# EAGLE design PaganiniClock (EAGLE 7.2.0)
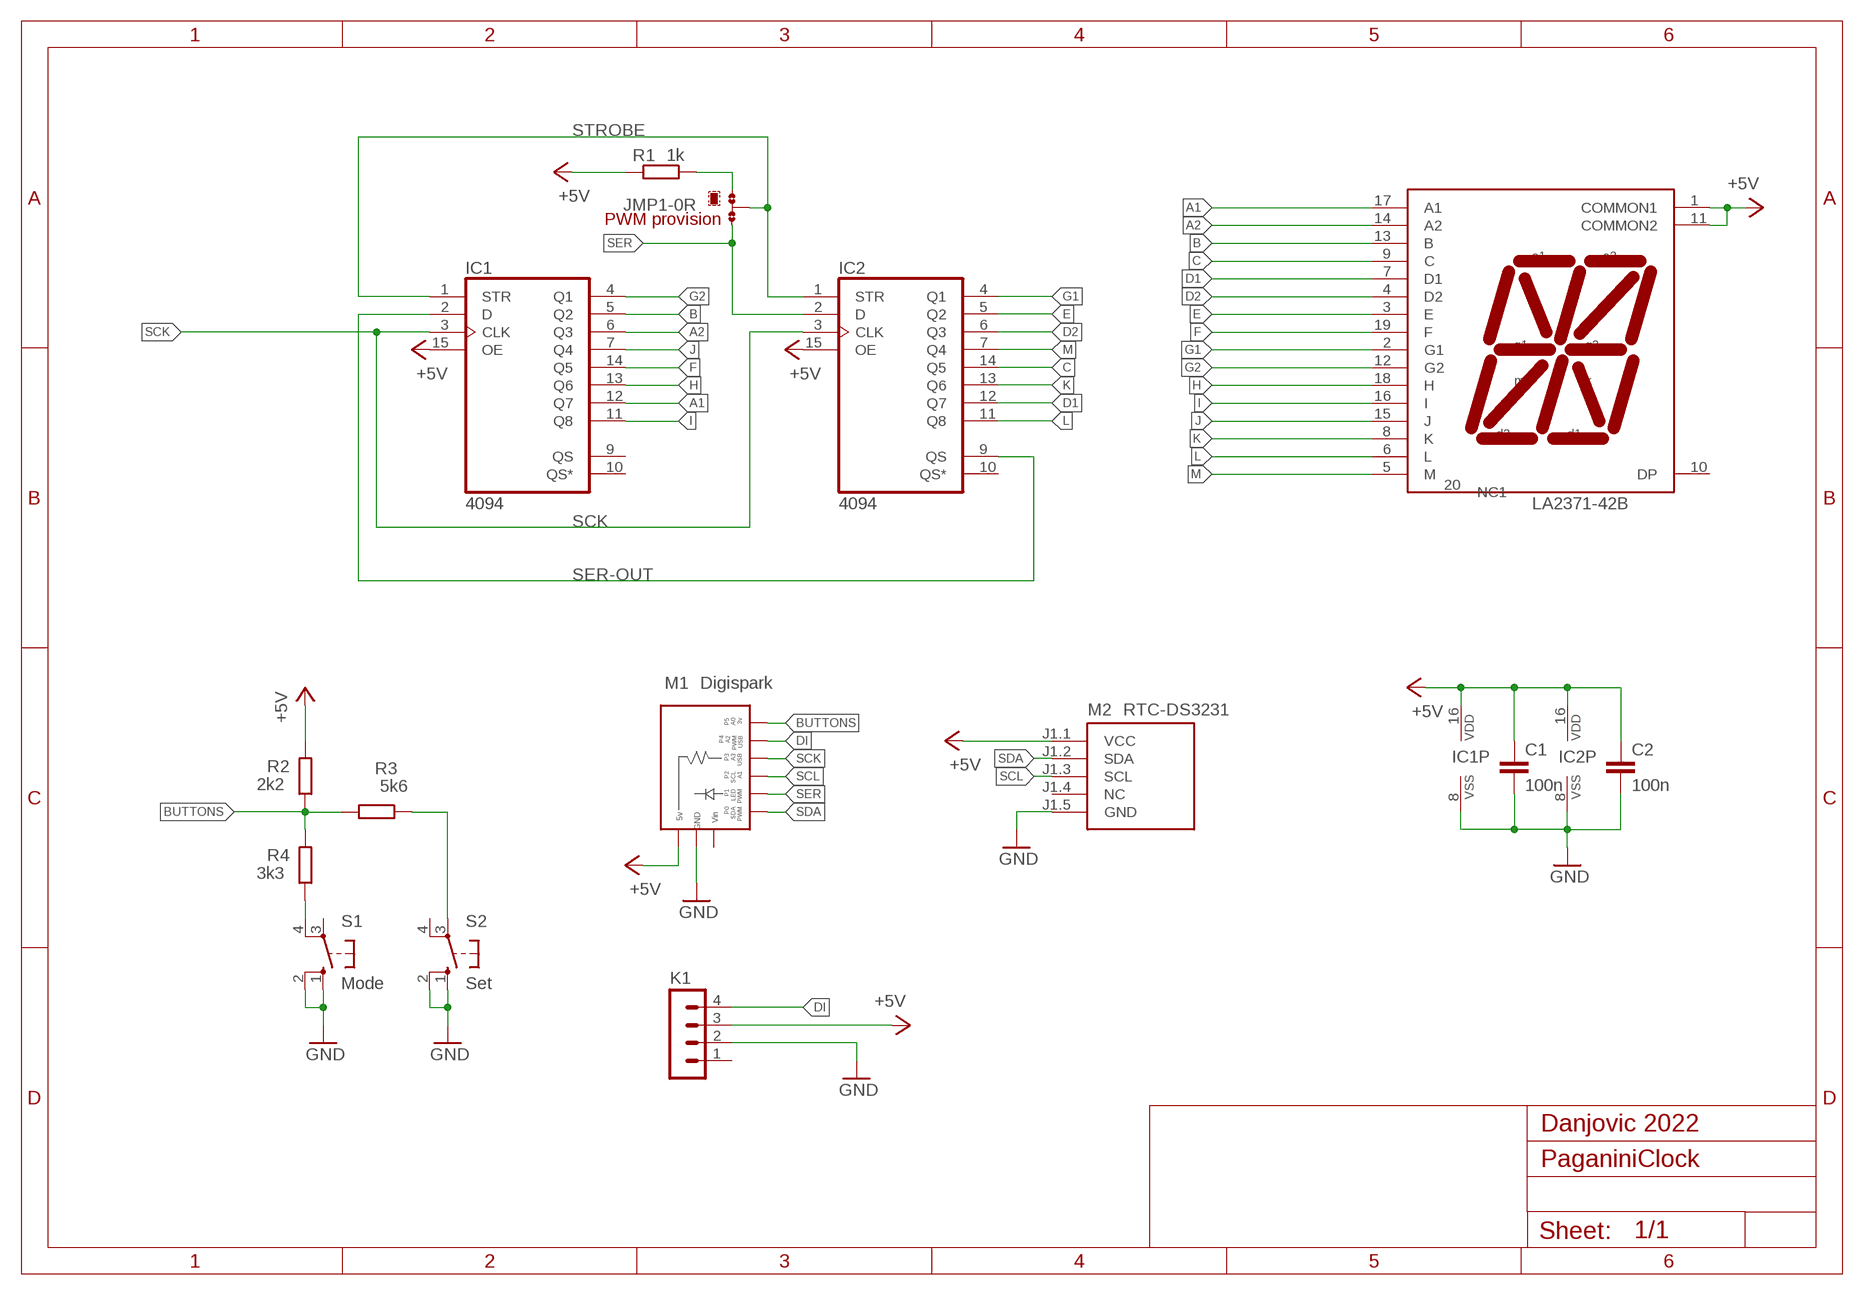
[diagram p0: schematic, sheet 1]

## Parts
C1  100n  C-EUC050-024X044L  [C050-024X044L]
C2  100n  C-EUC050-024X044L  [C050-024X044L]
DS1  LA2371-42B  LA(C)2371-42B-M1""  [LA(C)2371-42B-M1]
IC1  4094  [DIL16R]
IC2  4094  [DIL16R]
JMP1  DP_Option  0R-JUMPB  [B0R-JMP]
K1  MA04-1  [MA04-1]
M1  Digispark  DIGISPARK-SOCKET  [DIGISPARK_SOCKET]
M2  RTC-DS3231  [RTC-DS3231_SMALL]
R1  1k  R-EU_0204/7L  [0204/7L]
R2  2k2  R-EU_0204/7L  [0204/7L]
R3  5k6  R-EU_0204/7L  [0204/7L]
R4  3k3  R-EU_0204/7L  [0204/7L]
S1  10-XX  [B3F-10XX]
S2  10-XX  [B3F-10XX]

## Nets
+5V: C1.1 C2.1 DS1.1(COMMON1) DS1.11(COMMON2) IC1.15(OE) IC1.16(VDD) IC2.15(OE) IC2.16(VDD) K1.3 M1.5V M2.J1.1(VCC) R1.2 R2.2
A1: DS1.17(A1) IC1.12(Q7)
A2: DS1.14(A2) IC1.6(Q3)
B: DS1.13(B) IC1.5(Q2)
BUTTONS: M1.P5 R2.1 R3.2 R4.2
C: DS1.9(C) IC2.14(Q5)
D1: DS1.7(D1) IC2.12(Q7)
D2: DS1.4(D2) IC2.6(Q3)
DI: K1.4 M1.P4
E: DS1.3(E) IC2.5(Q2)
F: DS1.19(F) IC1.14(Q5)
G1: DS1.2(G1) IC2.4(Q1)
G2: DS1.12(G2) IC1.4(Q1)
GND: C1.2 C2.2 IC1.8(VSS) IC2.8(VSS) K1.2 M1.GND M2.J1.5(GND) S1.1(S) S1.2(S1) S2.1(S) S2.2(S1)
H: DS1.18(H) IC1.13(Q6)
I: DS1.16(I) IC1.11(Q8)
J: DS1.15(J) IC1.7(Q4)
K: DS1.8(K) IC2.13(Q6)
L: DS1.6(L) IC2.11(Q8)
M: DS1.5(M) IC2.7(Q4)
N$1: JMP1.1 R1.1
N$18: R3.1 S2.3(P)
N$20: R4.1 S1.4(P1)
SCK: IC1.3(CLK) IC2.3(CLK) M1.P3
SCL: M1.P2 M2.J1.3(SCL)
SDA: M1.P0 M2.J1.2(SDA)
SER: IC2.2(D) JMP1.3 M1.P1
SER-OUT: IC1.2(D) IC2.9(QS)
STROBE: IC1.1(STR) IC2.1(STR) JMP1.2
Unconnected: DS1.10(DP) DS1.20(NC1) IC1.9(QS) IC1.10(QS*) IC2.10(QS*) K1.1 M2.J1.4(NC) S1.3(P) S2.4(P1)

## Notes on the sheet
- PWM provision
- LA2371-42B
- Digispark
- Mode | Set
- Danjovic 2022

## Power pins joined to a net without a drawn wire
VIN: M1.VIN

## Library data of the parts
C1 C2 = rcl:C-EU: CAPACITOR, European symbol
DS1 = la2371-42b:LA(C)2371-42B-M1: PART NO. : LA(C)2371-42B-M1 EWRN 2.3"(56.8mm)SINGLE DIGIT DISPLAY http://www.ledtech.com.tw
IC1 IC2 = 40xx:4094: 8-stage SHIFT/STORE REGISTER, tri-state
JMP1 = jump-0r-smd:0R-JUMP: SMD 0R 0805 Jumper
K1 = con-lstb:MA04-1: PIN HEADER; OC_FARNELL: unknown; OC_NEWARK: unknown
M1 = Digistump:DIGISPARK: Digispark http://digistump.com/wiki/digispark
M2 = RTC:RTC-DS3231
R1-R4 = rcl:R-EU_: RESISTOR, European symbol
S1 S2 = switch-omron:10-XX: OMRON SWITCH; MPN: B3F-1000; OC_FARNELL: 176432; OC_NEWARK: 36M3542

## Board
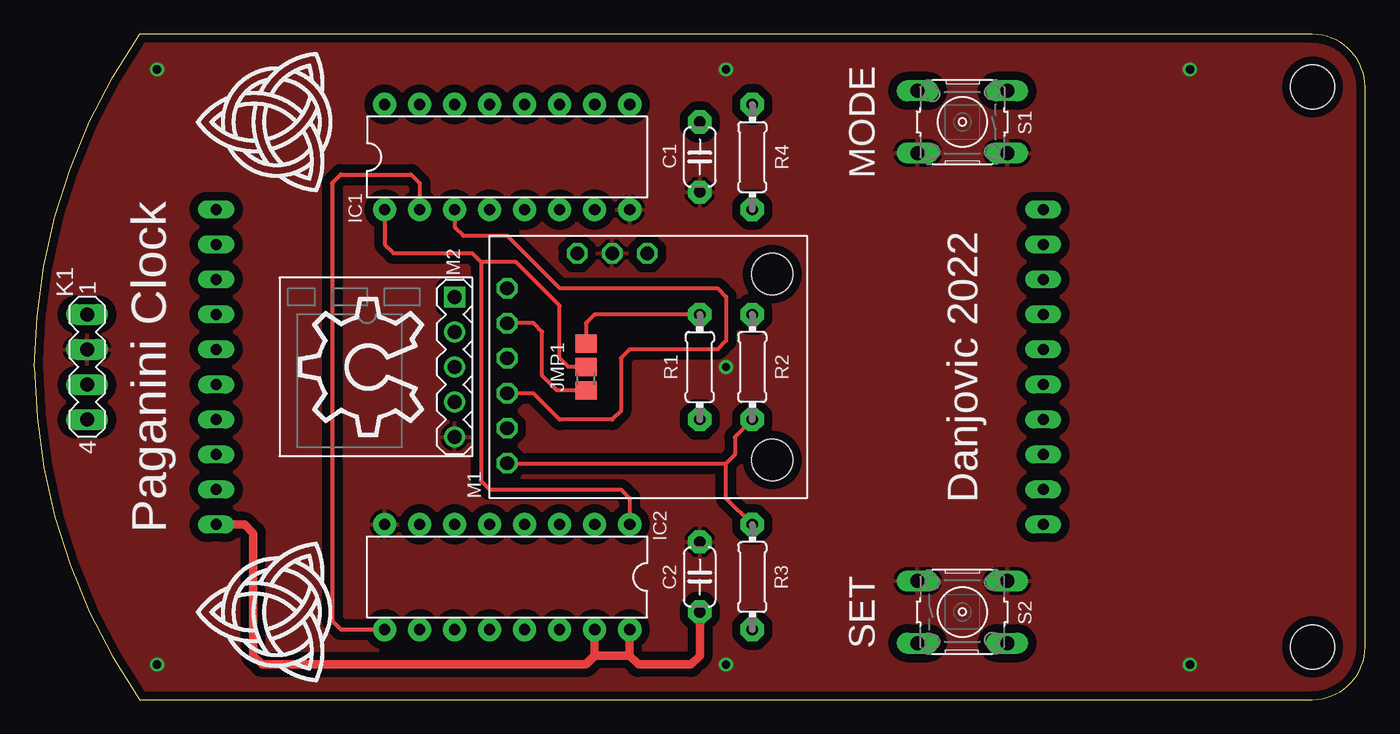
[diagram p1: board, top side]
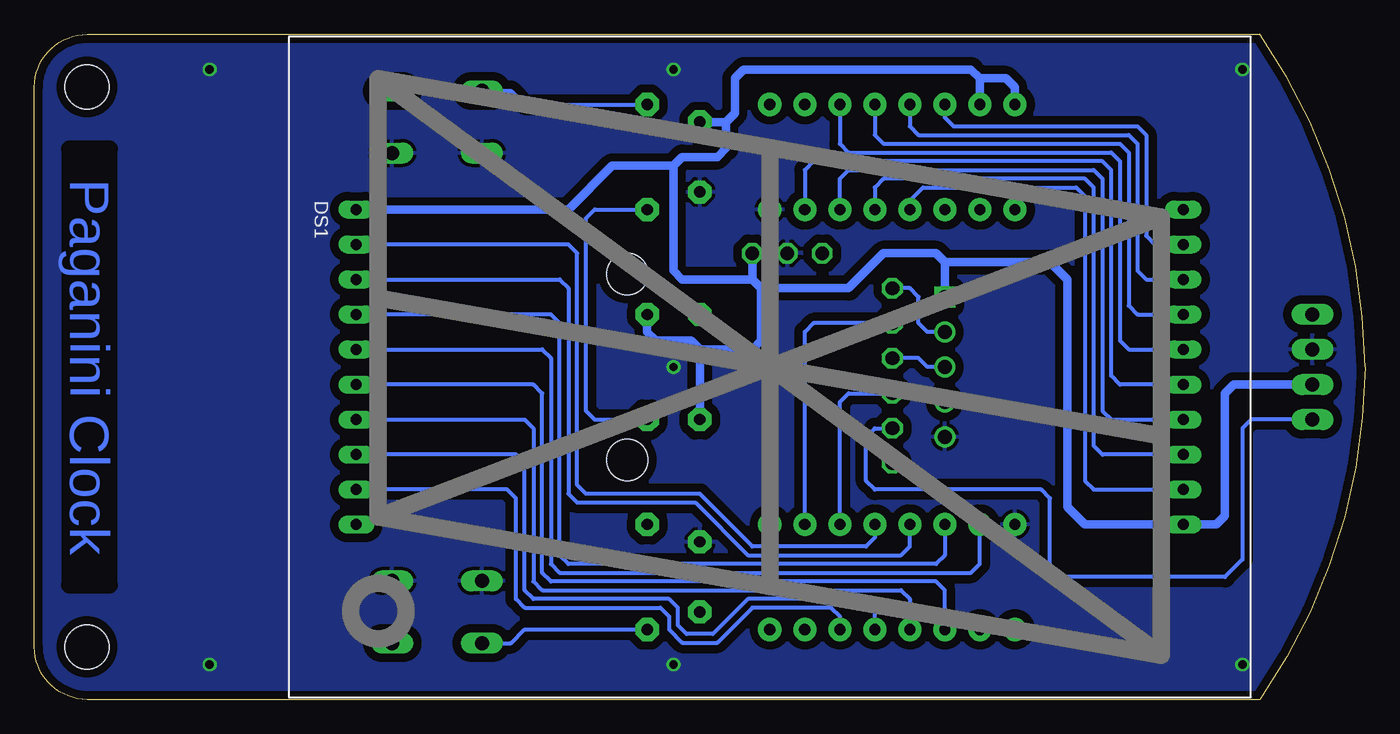
[diagram p2: board, bottom side, seen from below]

Size 96.52 x 48.26 mm. Coordinates in mm from the lower left corner, seen from the top.
Outline: 96.52,3.81 96.52,44.45 arc90 92.71,48.26 7.62,48.26 arc34 0,24.13 arc34 7.62,0 92.71,0 arc90 96.52,3.81
Copper layers (1*16): Top 0.035mm / dielectric 1.5mm / Bottom 0.035mm
Design rules "default *": minimum track width 10mil, minimum drill 24mil, track to track 8mil, track to pad 8mil, pad to pad 8mil, via to via 8mil, smd to smd 8mil, copper to edge 20mil, drill to drill 8mil, minimum pad ring 10mil, minimum via ring 8mil, stop-mask expansion 4mil, vias tented up to drill 0mil, thermal gap 10mil
Holes 3.2 mm at 92.71,3.81 92.71,44.45

### Footprints (pad centres in the part's own frame; a part is rotated, then mirrored left to right if it is on the bottom)
C050-024X044L = drill 0.813 pad 1.676 octagon: 1 -2.54,0; 2 2.54,0
LA(C)2371-42B-M1 = drill 0.8 long: 1 -11.43,-30; 2 -8.89,-30; 3 -6.35,-30; 4 -3.81,-30; 5 -1.27,-30; 6 1.27,-30; 7 3.81,-30; 8 6.35,-30; 9 8.89,-30; 10 11.43,-30; 11 11.43,30; 12 8.89,30; 13 6.35,30; 14 3.81,30; 15 1.27,30; 16 -1.27,30; 17 -3.81,30; 18 -6.35,30; 19 -8.89,30; 20 -11.43,30
DIL16R = drill 0.813 pad 1.676: 1 -8.89,-3.81; 2 -6.35,-3.81; 3 -3.81,-3.81; 4 -1.27,-3.81; 5 1.27,-3.81; 6 3.81,-3.81; 7 6.35,-3.81; 8 8.89,-3.81; 9 8.89,3.81; 10 6.35,3.81; 11 3.81,3.81; 12 1.27,3.81; 13 -1.27,3.81; 14 -3.81,3.81; 15 -6.35,3.81; 16 -8.89,3.81
B0R-JMP = smd 1.5 x 1.3: 1 0,1.7; 2 0,0; 3 0,-1.7
MA04-1 = drill 1.016 long: 1 -3.81,0; 2 -1.27,0; 3 1.27,0; 4 3.81,0
DIGISPARK_SOCKET = drill 1 octagon: 5V 17.78,-11.43; GND 17.78,-8.89; P0 15.24,-1.27; P1 12.7,-1.27; P2 10.16,-1.27; P3 7.62,-1.27; P4 5.08,-1.27; P5 2.54,-1.27; VIN 17.78,-6.35 | hole 3: 2.775,-20.5; 16.275,-20.5
RTC-DS3231_SMALL = drill 1 square: J1.1 -5.08,6.35 | drill 1: J1.2 -2.54,6.35; J1.3 0,6.35; J1.4 2.54,6.35; J1.5 5.08,6.35
0204/7L = drill 0.813 pad 1.676 octagon: 1 -3.81,0; 2 3.81,0
B3F-10XX = drill 1.016 long: 1 -3.251,2.261; 2 3.251,2.261; 3 -3.251,-2.261; 4 3.251,-2.261

### Placement (x,y rotation side)
C1  48.26,39.37 270 top
C2  48.26,8.89 90 top
DS1  43.18,24.13 270 bottom
IC1  34.29,39.37 0 top
IC2  34.29,8.89 180 top
JMP1  40.01,24.13 0 top
K1  3.81,24.13 270 top
M1  33.02,14.61 90 top
M2  24.13,24.13 270 top
R1  48.26,24.13 270 top
R2  52.07,24.13 90 top
R3  52.07,8.89 90 top
R4  52.07,39.37 270 top
S1  67.31,41.91 180 top
S2  67.31,6.35 0 top

### Tracks (layer width: path | path; a pad name or v marks a point on that pad's centre or on a via)
+5V
  Top 0.61: DS1.11 15.24,12.7 15.88,12.06 15.88,3.17 16.51,2.54 40.01,2.54 40.64,3.17 | 43.18,3.17 IC2.16 | IC2.15 40.64,3.17 | C2.1 48.26,3.17 47.62,2.54 43.81,2.54 43.18,3.17 | 43.18,3.17 40.64,3.17
  Bottom 0.61: IC1.16 25.4,44.45 26.04,45.09 27.94,45.09 | 27.94,45.09 28.57,45.72 45.09,45.72 45.72,45.09 45.72,42.55 46.35,41.91 | 30.48,31.75 31.11,32.38 34.92,32.38 37.47,29.84 43.81,29.84 | 44.45,30.48 M1.5V | M2.J1.1 30.48,31.75 | 30.48,31.75 22.86,31.75 21.59,30.48 21.59,13.97 20.32,12.7 DS1.11 10.79,12.7 10.16,13.34 10.16,22.23 9.53,22.86 K1.3 | IC1.15 27.94,45.09 | 50.16,38.73 49.53,39.37 46.99,39.37 46.35,40.01 46.35,41.91 | C1.1 46.35,41.91 | DS1.1 57.78,35.56 54.61,38.73 50.16,38.73 | 43.81,29.84 44.45,30.48 | R1.2 48.26,25.4 | 48.26,25.4 48.9,26.04 51.44,26.04 52.07,26.67 R2.2 | 44.45,30.48 49.53,30.48 50.16,31.11 50.16,38.73 | 43.81,29.84 43.81,26.04 44.45,25.4 48.26,25.4
A1
  Bottom 0.305: IC1.12 35.56,40.96 34.92,40.32 17.78,40.32 17.14,39.69 17.14,28.57 16.51,27.94 DS1.17
A2
  Bottom 0.305: IC1.6 38.1,37.78 37.47,38.42 19.68,38.42 19.05,37.78 19.05,20.95 18.41,20.32 DS1.14
B
  Bottom 0.305: DS1.13 19.05,17.78 19.68,18.41 19.68,37.15 20.32,37.78 34.92,37.78 35.56,37.15 IC1.5
BUTTONS
  Top 0.305: M1.P5 50.16,17.14 | R3.2 50.16,14.61 50.16,17.14 | R2.1 50.8,19.05 50.8,17.78 50.16,17.14
  Bottom 0.305: R4.2 55.88,35.56 56.52,34.92 56.52,20.95 55.88,20.32 R2.1
C
  Bottom 0.305: DS1.9 62.23,15.24 61.59,14.61 61.59,7.3 60.96,6.67 51.12,6.67 50.48,6.03 50.48,5.08 49.53,4.13 46.99,4.13 44.45,6.67 38.73,6.67 38.1,6.03 IC2.14
D1
  Bottom 0.305: DS1.7 60.96,20.32 60.33,19.68 60.33,8.57 59.69,7.94 33.66,7.94 33.02,7.3 IC2.12
D2
  Bottom 0.305: IC2.6 30.48,10.48 31.11,9.84 57.78,9.84 58.42,10.48 58.42,27.3 59.05,27.94 DS1.4
DI
  Bottom 0.305: K1.4 8.26,20.32 8.89,19.68 8.89,10.16 10.16,8.89 22.23,8.89 22.86,9.53 22.86,14.61 23.5,15.24 35.56,15.24 36.2,15.88 36.2,19.05 35.56,19.68 M1.P4
E
  Bottom 0.305: DS1.3 58.42,30.48 57.78,29.84 57.78,14.92 57.15,14.29 48.58,14.29 44.77,10.48 33.66,10.48 33.02,11.11 IC2.5
F
  Bottom 0.305: IC1.14 30.48,42.23 29.84,41.59 16.51,41.59 15.88,40.96 15.88,33.66 15.24,33.02 DS1.19
G1
  Bottom 0.305: IC2.4 35.56,11.75 36.2,11.11 44.45,11.11 48.26,14.92 56.52,14.92 57.15,15.56 57.15,32.38 57.78,33.02 DS1.2
G2
  Bottom 0.305: IC1.4 33.02,36.2 32.07,37.15 20.95,37.15 20.32,36.51 20.32,15.88 19.68,15.24 DS1.12
GND  (via drill 0.6)
  other vias: 50.16,24.13 50.16,45.72 50.16,2.54 83.82,45.72 83.82,2.54 8.89,2.54 8.89,45.72
  pour Bottom (isolate 0.61): 96.52,0 0,0 0,48.26 96.52,48.26
  pour Top (isolate 0.61): 96.52,0 0,0 0,48.26 96.52,48.26
H
  Bottom 0.305: IC1.13 33.02,41.59 32.38,40.96 17.14,40.96 16.51,40.32 16.51,31.11 15.88,30.48 DS1.18
I
  Bottom 0.305: IC1.11 38.1,40.32 37.47,39.69 18.41,39.69 17.78,39.05 17.78,26.04 17.14,25.4 DS1.16
J
  Bottom 0.305: DS1.15 17.78,22.86 18.41,23.5 18.41,38.42 19.05,39.05 40.01,39.05 40.64,38.42 IC1.7
K
  Bottom 0.305: IC2.13 35.56,6.67 36.2,7.3 44.77,7.3 47.31,4.76 49.21,4.76 49.85,5.4 49.85,6.67 50.48,7.3 60.33,7.3 60.96,7.94 60.96,17.14 61.59,17.78 DS1.8
L
  Bottom 0.305: IC2.11 30.48,7.94 31.11,8.57 59.05,8.57 59.69,9.21 59.69,22.23 60.33,22.86 DS1.6
M
  Bottom 0.305: DS1.5 59.69,25.4 59.05,24.77 59.05,9.84 58.42,9.21 28.57,9.21 27.94,9.84 IC2.7
N$1
  Top 0.305: R1.1 40.64,27.94 40.01,27.3 JMP1.1
N$18
  Bottom 0.305: S2.3 61.95,4.09 60.96,5.08 R3.1
N$20
  Bottom 0.305: S1.4 61.95,44.17 60.96,43.18 R4.1
SCK
  Top 0.305: IC1.3 30.48,34.29 31.11,33.66 34.29,33.66 38.1,29.84 49.53,29.84 50.16,29.21 50.16,26.04 49.53,25.4 43.18,25.4 42.55,24.77 42.55,20.95 41.91,20.32 38.1,20.32 36.2,22.23 M1.P3
  Bottom 0.305: IC2.3 38.1,21.59 37.47,22.23 M1.P3
SCL
  Bottom 0.305: M2.J1.3 31.75,24.13 32.38,24.77 M1.P2
SDA
  Bottom 0.305: M2.J1.2 31.75,26.67 32.38,27.3 32.38,29.21 33.02,29.84 M1.P0
SER
  Top 0.305: JMP1.3 37.9,22.43 36.83,23.5 36.83,26.67 36.2,27.3 M1.P1
  Bottom 0.305: M1.P1 40.01,27.3 40.64,26.67 IC2.2
SER-OUT
  Top 0.305: IC2.9 22.23,5.08 21.59,5.71 21.59,37.47 22.23,38.1 27.3,38.1 27.94,37.47 IC1.2
STROBE
  Top 0.305: IC1.1 25.4,33.02 26.04,32.38 31.75,32.38 32.38,31.75 | 32.38,31.75 32.38,15.88 33.02,15.24 42.55,15.24 43.18,14.61 IC2.1 | JMP1.2 38.73,24.13 38.1,24.77 38.1,28.57 34.92,31.75 32.38,31.75

### Text on the board
Bottom: Paganini Clock
tPlace: MODE | Paganini Clock | Danjovic 2022 | SET
bStop: Paganini Clock